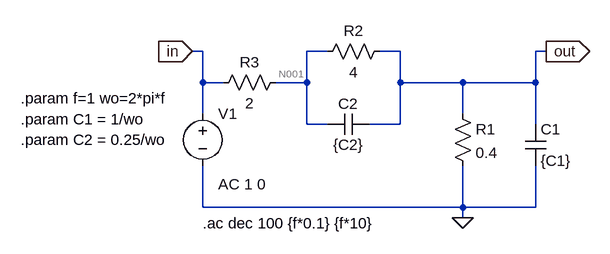
[diagram p0: schematic EJ2_Y.asc]
EJ2_Y.asc, the LTspice schematic file:
Version 4
SHEET 1 880 680
WIRE -64 48 -80 48
WIRE 128 48 96 48
WIRE 240 48 208 48
WIRE 464 48 448 48
WIRE -64 96 -64 48
WIRE -32 96 -64 96
WIRE 96 96 96 48
WIRE 96 96 48 96
WIRE 240 96 240 48
WIRE 336 96 240 96
WIRE 448 96 448 48
WIRE 448 96 336 96
WIRE -64 144 -64 96
WIRE 336 144 336 96
WIRE 96 160 96 96
WIRE 128 160 96 160
WIRE 240 160 240 96
WIRE 240 160 192 160
WIRE 448 160 448 96
WIRE -64 288 -64 224
WIRE 336 288 336 224
WIRE 336 288 -64 288
WIRE 448 288 448 224
WIRE 448 288 336 288
WIRE 336 304 336 288
FLAG 336 304 0
FLAG -80 48 in
IOPIN -80 48 In
FLAG 464 48 out
IOPIN 464 48 Out
SYMBOL res 64 80 R90
WINDOW 0 0 56 VBottom 2
WINDOW 3 32 56 VTop 2
SYMATTR InstName R3
SYMATTR Value 2
SYMBOL res 224 32 R90
WINDOW 0 0 56 VBottom 2
WINDOW 3 32 56 VTop 2
SYMATTR InstName R2
SYMATTR Value 4
SYMBOL cap 192 144 R90
WINDOW 0 0 32 VBottom 2
WINDOW 3 32 32 VTop 2
SYMATTR InstName C2
SYMATTR Value {C2}
SYMBOL res 320 128 R0
SYMATTR InstName R1
SYMATTR Value 0.4
SYMBOL cap 432 160 R0
SYMATTR InstName C1
SYMATTR Value {C1}
SYMBOL voltage -64 128 R0
WINDOW 123 24 124 Left 2
WINDOW 39 0 0 Left 0
SYMATTR InstName V1
SYMATTR Value ""
SYMATTR Value2 AC 1 0
TEXT -344 120 Left 2 !.param f=1 wo=2*pi*f
TEXT -344 152 Left 2 !.param C1 = 1/wo
TEXT -344 184 Left 2 !.param C2 = 0.25/wo
TEXT -64 312 Left 2 !.ac dec 100 {f*0.1} {f*10}

The netlist it stands for:
* EJ2_Y.asc
R3 N001 in 2
R2 out N001 4
C2 out N001 {C2}
R1 out 0 0.4
C1 out 0 {C1}
V1 in 0 AC 1 0
.param f=1 wo=2*pi*f
.param C1 = 1/wo
.param C2 = 0.25/wo
.ac dec 100 {f*0.1} {f*10}
.backanno
.end

* Results of the author's LTspice run, read from the files saved beside the schematic
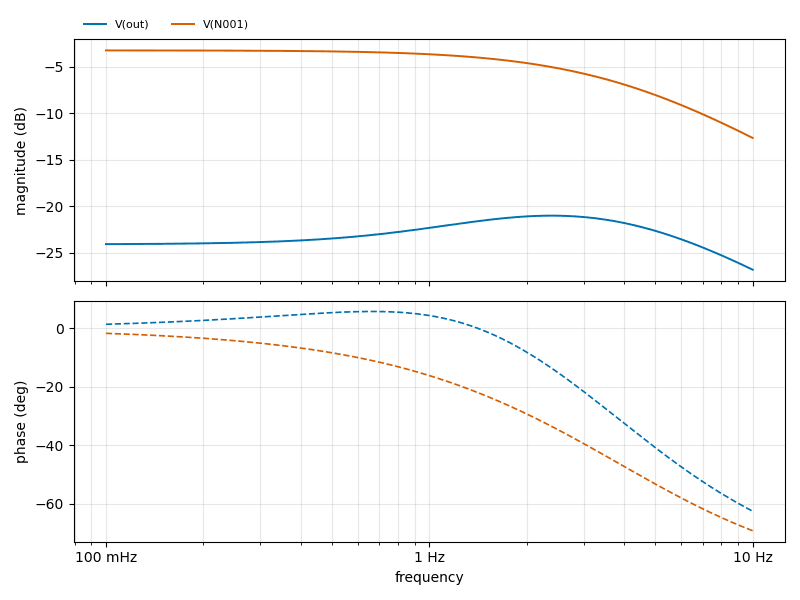
[diagram p1: AC Analysis of EJ2_Y.asc, plotted from the saved traces]
* AC Analysis, 1 run:
*   V(out): -24.05 dB at 100 mHz, -26.79 dB at 10 Hz, peak -20.99 dB at 2.399 Hz, 3 dB below the peak at 165.1 mHz and 6.542 Hz
*   V(N001): -3.26 dB at 100 mHz, -12.65 dB at 10 Hz, peak -3.26 dB at 100 mHz, 3 dB below the peak at 3.446 Hz